# Altium schematic sheet 02_Power.SchDoc
size A4; CheckedBy: <审核日期>; Author: llm; CompanyName: 孔乙己图书店; DocumentNumber: 2; SheetNumber: 2; SheetTotal: 6; PageSetup: Record=PageOptions|CenterHorizontal=True|CenterVertical=True|PrintScale=1.00|XCorrection=1.00|YCorrection=1.00|PrintKind=0|BorderSize=5000000|LeftOffset=0|BottomOffset=0|Orientation=2|PaperLength=1000|PaperWidth=1000|Scale=100|PaperSource=7|PrintQuality=600|MediaType=1|DitherType=10|PaperKind=A4|PrintScaleMode=1; DesignDate: <设计日期>; CheckDate: <审核人员>; SheetName: 电源; SheetVersion: Rev.F; SheetDescription: <图纸描述>; productName: Fly-Balance
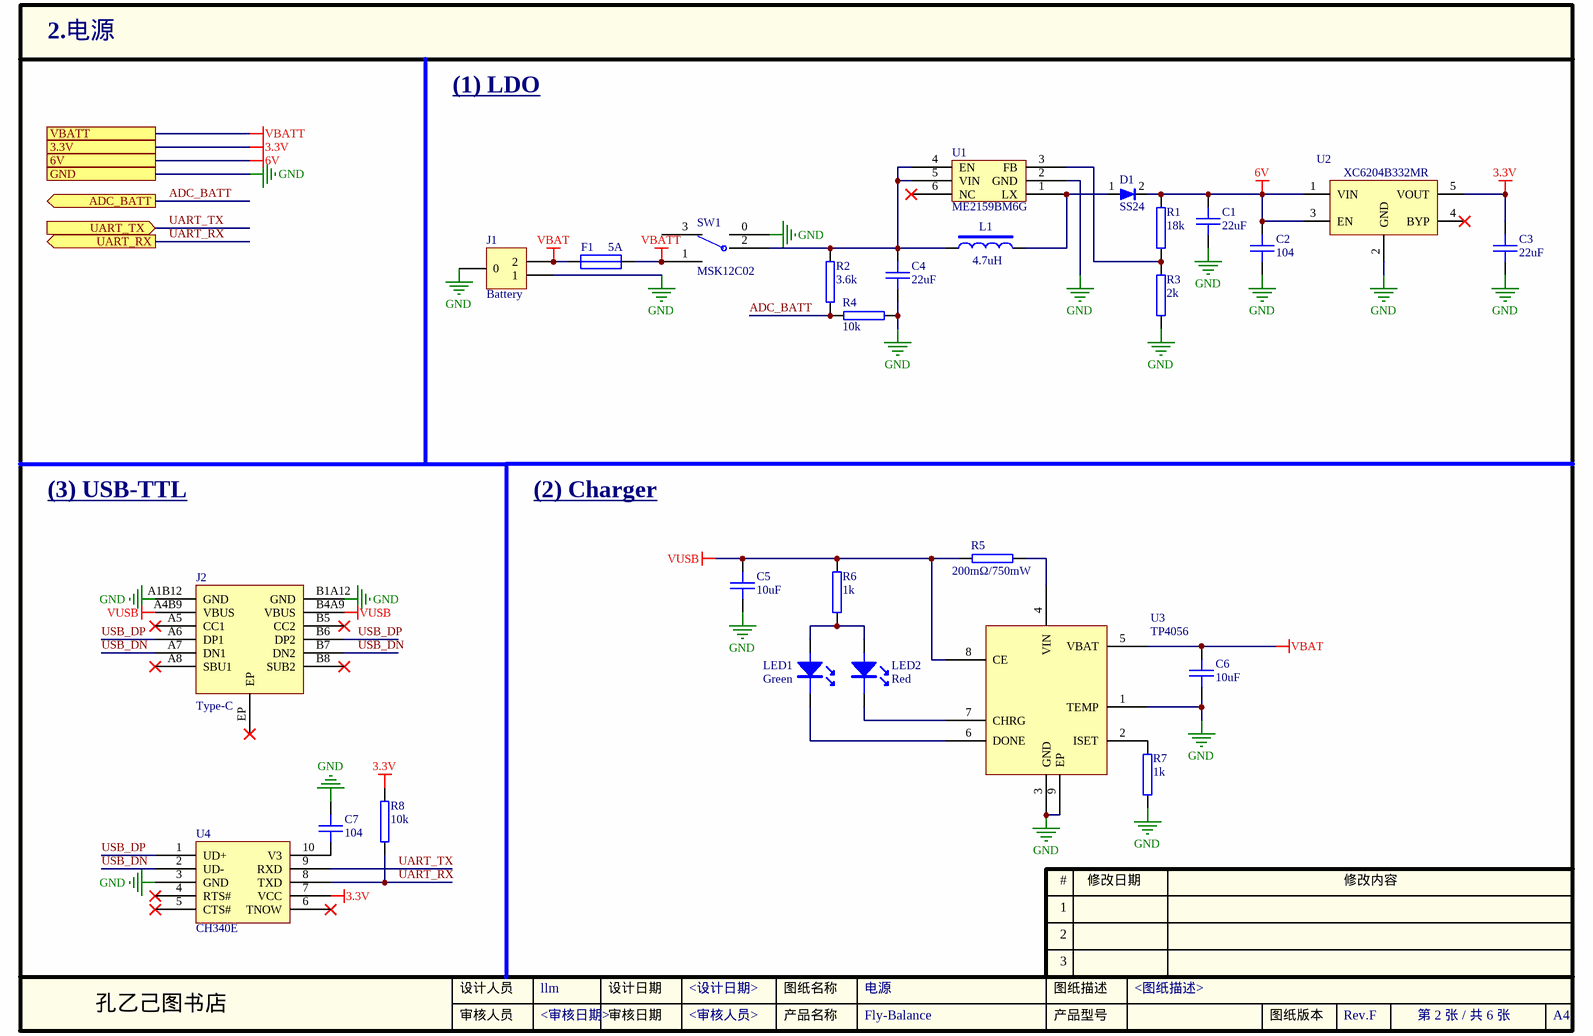
[diagram p0: 02_Power.SchDoc]

## Parts
C1  22uF  [0805C]
C2  104  [0402C]
C3  22uF  [0805C]
C4  22uF  [0805C]
C5  10uF  [0805C]
C6  10uF  [0805C]
C7  104  [0402C]
D1  SS24  [SMA_L4.3-W2.5-LS5.0-RD]
F1  5A  [1206R]
J1  Battery  [51005母座]
J2  Type-C  [USB-C-SMD_TYPE-C-16P-1]
L1  4.7uH  [IND-SMD_L5.0-W5.0_FNR50XXS]
LED1  Green  [LED-0603]
LED2  Red  [LED-0603]
R1  18k  [0402R]
R2  3.6k  [0402R]
R3  2k  [0402R]
R4  10k  [0402R]
R5  200mΩ/750mW  [2010R]
R6  1k  [0402R]
R7  1k  [0402R]
R8  10k  [0402R]
SW1  MSK12C02  [MSK12C02]
U1  ME2159BM6G  [SOT-23-6_L2.9-W1.6-P0.95-LS2.8-BR]
U2  XC6204B332MR  [SOT-23-5]
U3  TP4056  [ESOP-8_L4.9-W3.9-P1.27-LS6.0-BL-EP]
U4  CH340E  [MSOP-10_L3.0-W3.0-P0.50-LS5.0-BL]

## Ports
3.3V, 6V, ADC_BATT (out), GND, UART_RX (out), UART_TX (in), VBATT

## Nets
3.3V: C3.1 R8.2 U2.5(VOUT) U4.7(VCC) ; port 3.3V
6V: C1.1 C2.1 D1.2 R1.2 U2.1(VIN) U2.3(EN) ; port 6V
GND: C1.2 C2.2 C3.2 C4.2 C5.2 C6.2 C7.2 J1.0 J1.1 J2.A1B12(GND) J2.B1A12(GND) R3.1 R4.1 R7.1 SW1.0 U1.2(GND) U2.2(GND) U3.1(TEMP) U3.3(GND) U3.9(EP) U4.3(GND) ; port GND
VBAT: C6.1 F1.2 J1.2 U3.5(VBAT)
VBATT: F1.1 SW1.1 ; port VBATT
VUSB: C5.1 J2.A4B9(VBUS) J2.B4A9(VBUS) R5.2 R6.2 U3.8(CE)
ADC_BATT: R2.1 R4.2 ; port ADC_BATT
UART_RX: R8.1 U4.8(TXD) ; port UART_RX
UART_TX: U4.9(RXD) ; port UART_TX
USB_DN: J2.A7(DN1) J2.B7(DN2) U4.2(UD-)
USB_DP: J2.A6(DP1) J2.B6(DP2) U4.1(UD+)
NetC4_1: C4.1 L1.1 R2.2 SW1.2 U1.4(EN) U1.5(VIN)
NetC7_1: C7.1 U4.10(V3)
NetD1_1: D1.1 L1.2 U1.1(LX)
NetLED1_1: LED1.1 LED2.1 R6.1
NetLED1_2: LED1.2 U3.6(DONE)
NetLED2_2: LED2.2 U3.7(CHRG)
NetR1_1: R1.1 R3.2 U1.3(FB)
NetR5_1: R5.1 U3.4(VIN)
NetR7_2: R7.2 U3.2(ISET)

Not connected (* = marked no-connect by the designer): J2 A5(CC1)* A8(SBU1)* B5(CC2)* B8(SUB2)* EP*; SW1 3; U1 6(NC)*; U2 4(BYP)*; U4 4(RTS#)* 5(CTS#)* 6(TNOW)*

## Notes on the sheet
- (1) LDO
- (3) USB-TTL
- (2) Charger
- 1
- #
- 修改日期
- 修改内容
- 2
- 3
- 设计人员
- 审核人员
- 设计日期
- 审核日期
- 产品名称
- 图纸名称
- 产品型号
- 图纸描述
- 图纸版本
- A4

## Library data of the parts
C1-C7 = CAP: 电容
D1 = DIODE: 二极管
F1 = Fuse: 保险丝
J1 = CON: 直流电机接口
L1 = INDUCTOR_2: 电感
LED1 LED2 = LED: 发光二极管; Value: 0603Red,SMD
R1-R8 = RES: 电阻
SW1 = 单刀双掷开关
U1 = ME2159BM6G: DC-DC升压芯片
U2 = ZL6205A30TS5: LDO, 3.0V输出
U3 = 4056: 单节锂电池充电芯片
U4 = CH340E: USB-TTL芯片